# EAGLE design LickSensor_V3 (EAGLE 9.4.2)
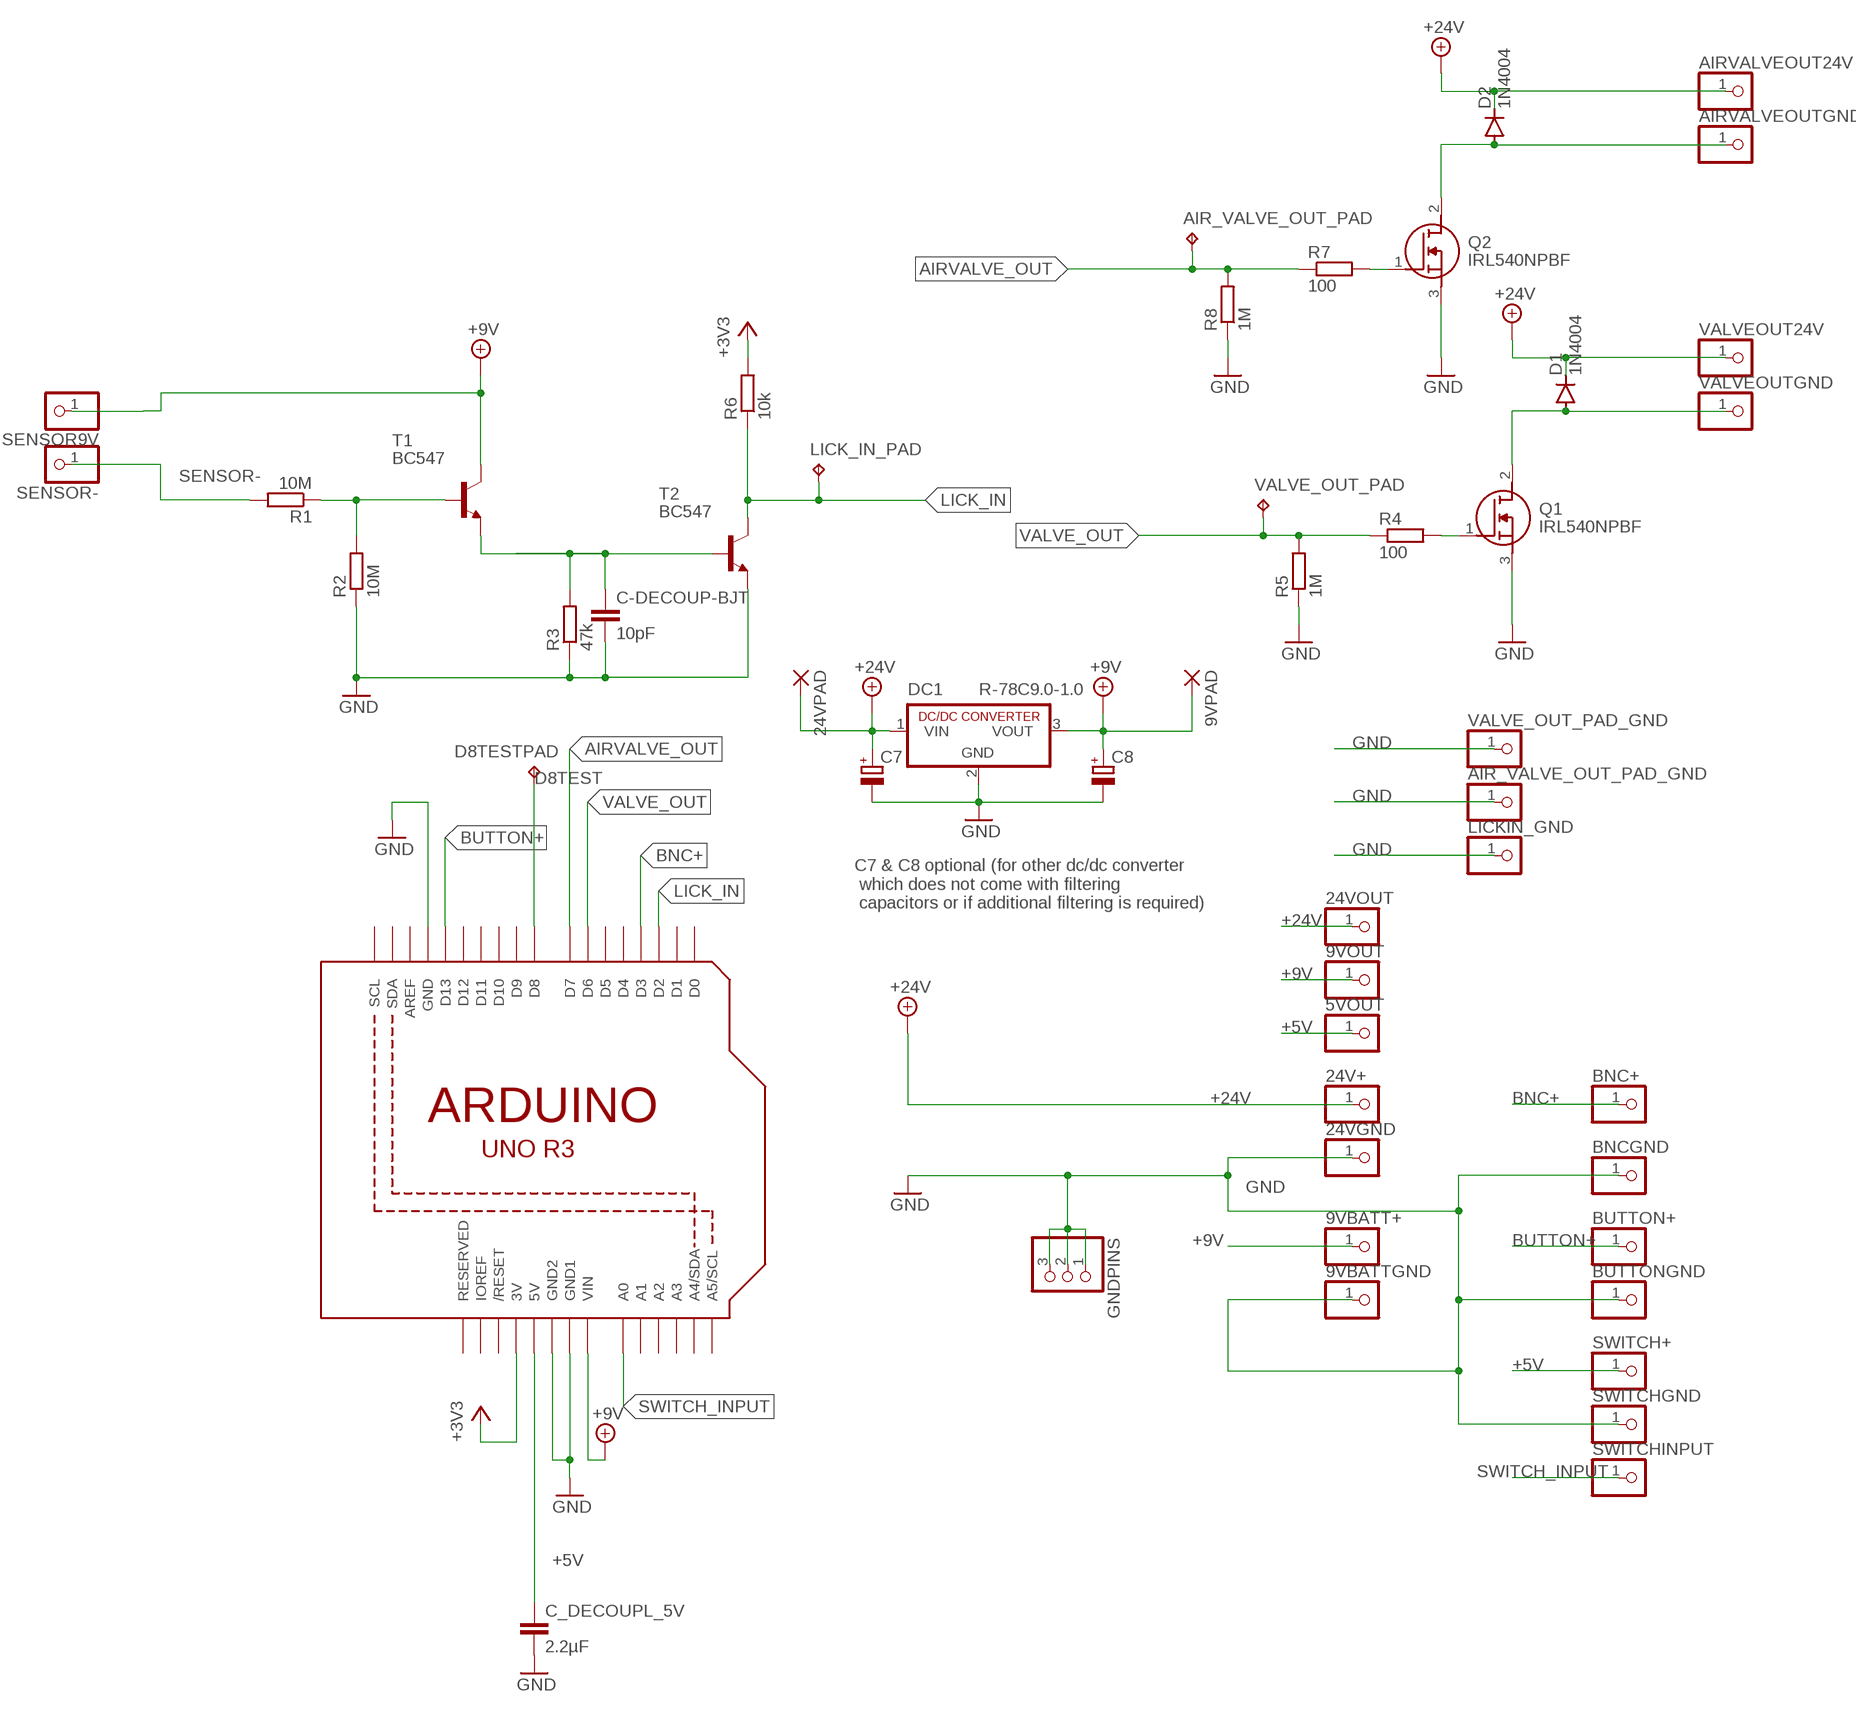
[diagram p0: schematic, sheet 1]

## Parts
5VOUT  PINHD-1X1  [1X01]
9VBATT+  PINHD-1X1  [1X01]
9VBATTGND  PINHD-1X1  [1X01]
9VOUT  PINHD-1X1  [1X01]
9VPAD  1,6/0,8  [1,6/0,8]
24V+  PINHD-1X1  [1X01]
24VGND  PINHD-1X1  [1X01]
24VOUT  PINHD-1X1  [1X01]
24VPAD  1,6/0,8  [1,6/0,8]
AIR_VALVE_OUT_PAD  TPPAD1-13  [P1-13]
AIR_VALVE_OUT_PAD_GND  PINHD-1X1  [1X01]
AIRVALVEOUT24V  PINHD-1X1  [1X01]
AIRVALVEOUTGND  PINHD-1X1  [1X01]
BNC+  PINHD-1X1  [1X01]
BNCGND  PINHD-1X1  [1X01]
BUTTON+  PINHD-1X1  [1X01]
BUTTONGND  PINHD-1X1  [1X01]
C7  CPOL-EUTT2D6  [TT2D6]
C8  CPOL-EUTT2D6  [TT2D6]
C-DECOUP-BJT  10pF  C-EU050-030X075  [C050-030X075]
C_DECOUPL_5V  2.2µF  C-EU050-030X075  [C050-030X075]
D1  1N4004  [DO41-10]
D2  1N4004  [DO41-10]
D8TESTPAD  TPPAD1-13  [P1-13]
DC1  R-78C9.0-1.0  [SIP3]
GNDPINS  PINHD-1X3  [1X03]
LICK_IN_PAD  TPPAD1-13  [P1-13]
LICKIN_GND  PINHD-1X1  [1X01]
Q1  IRL540NPBF  [TO254P469X1042X1967-3P]
Q2  IRL540NPBF  [TO254P469X1042X1967-3P]
R1  10M  R-EU_0207/7  [0207/7]
R2  10M  R-EU_0207/7  [0207/7]
R3  47k  R-EU_0207/7  [0207/7]
R4  100  R-EU_0204/7  [0204/7]
R5  1M  R-EU_0204/7  [0204/7]
R6  10k  R-EU_0204/7  [0204/7]
R7  100  R-EU_0204/7  [0204/7]
R8  1M  R-EU_0204/7  [0204/7]
SENSOR9V  PINHD-1X1  [1X01]
SENSOR-  PINHD-1X1  [1X01]
SWITCH+  PINHD-1X1  [1X01]
SWITCHGND  PINHD-1X1  [1X01]
SWITCHINPUT  PINHD-1X1  [1X01]
T1  BC547  [TO92]
T2  BC547  [TO92]
U1  ARDUINOR3-DIMENSION  [ARDUINOR3]
VALVE_OUT_PAD  TPPAD1-13  [P1-13]
VALVE_OUT_PAD_GND  PINHD-1X1  [1X01]
VALVEOUT24V  PINHD-1X1  [1X01]
VALVEOUTGND  PINHD-1X1  [1X01]

## Nets
+3V3: R6.2 U1.3V
+5V: 5VOUT.1 C_DECOUPL_5V.1 SWITCH+.1 U1.5V
+9V: 9VBATT+.1 9VOUT.1 9VPAD.1(P) C8.+ DC1.3(VOUT) SENSOR9V.1 T1.3(C) U1.VIN
+24V: 24V+.1 24VOUT.1 24VPAD.1(P) AIRVALVEOUT24V.1 C7.+ D1.C D2.C DC1.1(VIN) VALVEOUT24V.1
AIRVALVE_OUT: AIR_VALVE_OUT_PAD.TP R7.1 R8.2 U1.D7
BNC+: BNC+.1 U1.D3
BUTTON+: BUTTON+.1 U1.D13
D8TEST: D8TESTPAD.TP U1.D8
GND: 9VBATTGND.1 24VGND.1 AIR_VALVE_OUT_PAD_GND.1 BNCGND.1 BUTTONGND.1 C7.- C8.- C-DECOUP-BJT.2 C_DECOUPL_5V.2 DC1.2(GND) GNDPINS.1 GNDPINS.2 GNDPINS.3 LICKIN_GND.1 Q1.3(S) Q2.3(S) R2.1 R3.1 R5.1 R8.1 SWITCHGND.1 T2.1(E) U1.GND U1.GND1 U1.GND2 VALVE_OUT_PAD_GND.1
GND1: D1.A Q1.2(D) VALVEOUTGND.1
GND2: AIRVALVEOUTGND.1 D2.A Q2.2(D)
LICK_IN: LICK_IN_PAD.TP R6.1 T2.3(C) U1.D2
N$1: Q2.1(G) R7.2
N$4: Q1.1(G) R4.2
N$10: C-DECOUP-BJT.1 R3.2 T1.1(E) T2.2(B)
N$11: R1.1 R2.2 T1.2(B)
SENSOR-: R1.2 SENSOR-.1
SWITCH_INPUT: SWITCHINPUT.1 U1.A0
VALVE_OUT: R4.1 R5.2 U1.D6 VALVE_OUT_PAD.TP
Unconnected: U1.A1 U1.A2 U1.A3 U1.A4(A4/SDA) U1.A5(A5/SCL) U1.AREF U1.D0 U1.D1 U1.D4 U1.D5 U1.D9 U1.D10 U1.D11 U1.D12 U1.IOREF U1.RESERVED U1.RESET(/RESET) U1.SCL U1.SDA

## Notes on the sheet
- C7 & C8 optional (for other dc/dc converter
   which does not come with filtering
   capacitors or if additional filtering is required)

## Library data of the parts
5VOUT 9VBATT+ 9VBATTGND 9VOUT 24V+ 24VGND 24VOUT AIR_VALVE_OUT_PAD_GND AIRVALVEOUT24V AIRVALVEOUTGND BNC+ BNCGND BUTTON+ BUTTONGND LICKIN_GND SENSOR9V SENSOR- SWITCH+ SWITCHGND SWITCHINPUT VALVE_OUT_PAD_GND VALVEOUT24V VALVEOUTGND = adafruit:PINHD-1X1: Pin header 1x1 for 0.1" spacing With round pins
9VPAD 24VPAD = wirepad:1,6/0,8: THROUGH-HOLE PAD
AIR_VALVE_OUT_PAD D8TESTPAD LICK_IN_PAD VALVE_OUT_PAD = testpad:TP: Test pad
C7 C8 = rcl:CPOL-EU: POLARIZED CAPACITOR, European symbol; SPICEPREFIX: C
C-DECOUP-BJT C_DECOUPL_5V = rcl:C-EU: CAPACITOR, European symbol; SPICEPREFIX: C
D1 D2 = diode:1N4004: DIODE general purpose rectifier, 1 A
DC1 = dc-dc-converter:R-78C*-1.0: INNOLINE DC/DC-Converter 1.0 AMP SIP3 Single Output Source: Data sheet <http://www.mikrocontroller.net/attachment/150645/157764-da-01-en-DC_DC_WANDLER_R_78C5_0_1_0.pdf>
GNDPINS = adafruit:PINHD-1X3: PIN HEADER
Q1 Q2 = SamacSys_Parts:IRL540NPBF: N-channel MOSFET,IRL540N 30A 100V Source: Datasheet <https://www.infineon.com/dgdl/irl540npbf.pdf?fileId=5546d462533600a40153565fc2a62567>; ALLIED_NUMBER: 70017094; ALLIED_PRICE-STOCK: http://www.alliedelec.com/international-rectifier-irl540npbf/70017094/; DESCRIPTION: N-channel MOSFET,IRL540N 30A 100V; HEIGHT: 4.69mm; MANUFACTURER_NAME: International Rectifier; MANUFACTURER_PART_NUMBER: IRL540NPBF; MOUSER_PART_NUMBER: 942-IRL540NPBF; MOUSER_PRICE-STOCK: http://www.mouser.com/Search/ProductDetail.aspx?qs=9%252bKlkBgLFf0uZBCvyYsQoQ%3d%3d; RS_PART_NUMBER: 2509056052; RS_PRICE-STOCK: http://uk.rs-online.com/web/p/products/2509056052
R1-R8 = rcl:R-EU_: RESISTOR, European symbol; SPICEPREFIX: R
T1 T2 = transistor:BC547: NPN TRANSISTOR
U1 = adafruit:ARDUINOR3: This is a new object for the new Arduino R3 - with extra pins that you may want to use (such as IOref, and duplicated A4/A5

## Module TEST
Ports: 

### Library data of the parts

## Board
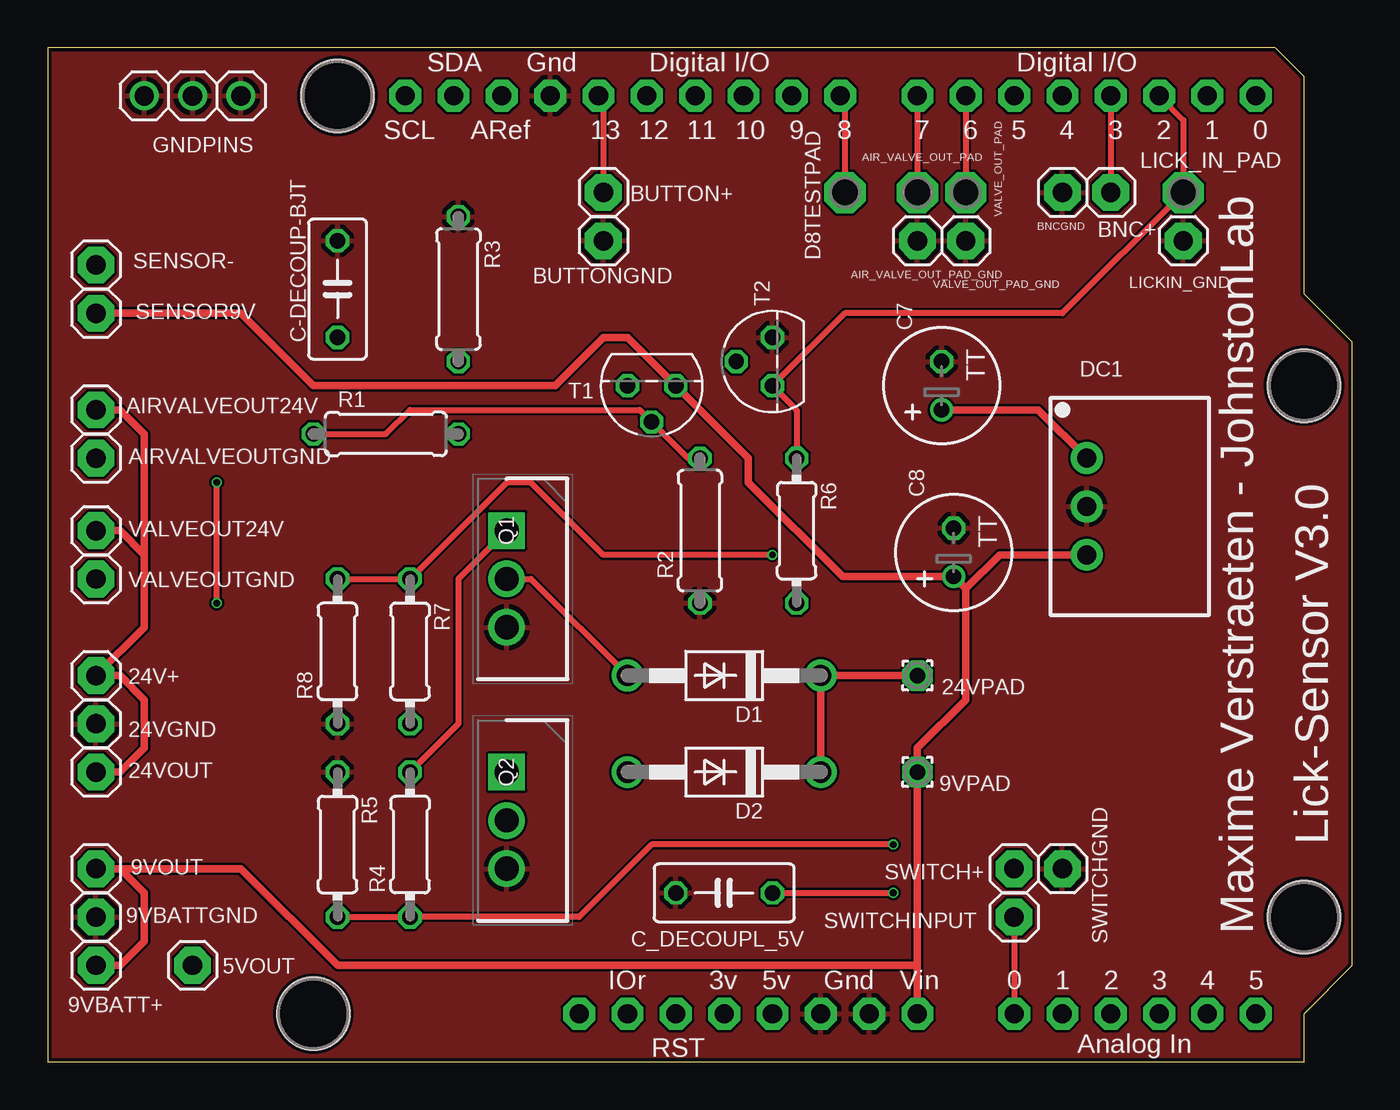
[diagram p1: board, top side]
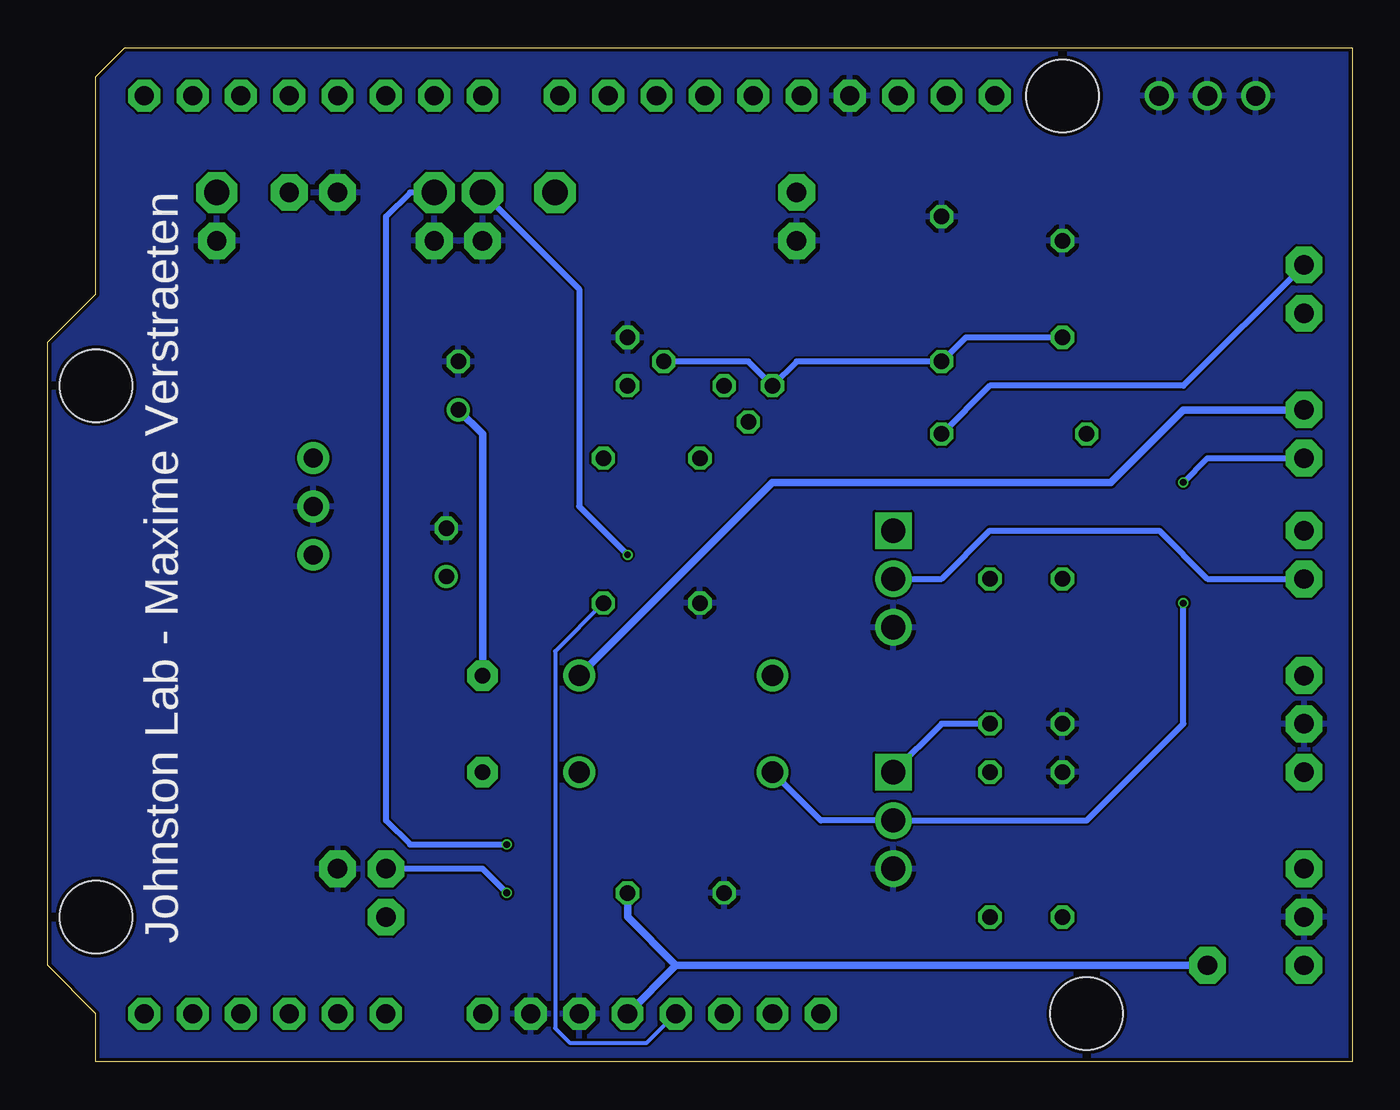
[diagram p2: board, bottom side, seen from below]

Size 68.58 x 53.34 mm. Coordinates in mm from the lower left corner, seen from the top.
Copper layers (1*16): Top 0.035559375mm / dielectric 1.6mm / Bottom 0.035559375mm
Design rules "jlcpcb2layer": minimum track width 5mil, minimum drill 12mil, track to track 5mil, track to pad 5mil, pad to pad 5mil, via to via 5mil, smd to smd 5mil, copper to edge 8mil, drill to drill 6mil, minimum pad ring 5mil, minimum via ring 3mil, stop-mask expansion 2.5mil, vias tented up to drill 0mil, thermal gap 10mil
Holes 3.81 mm at 15.24,50.8 66.04,35.56 66.04,7.62 13.97,2.54

### Footprints (pad centres in the part's own frame; a part is rotated, then mirrored left to right if it is on the bottom)
1X01 = drill 1.016 pad 1.93 octagon: 1 0,0
1,6/0,8 = drill 0.813 pad 1.6 octagon: 1 0,0
P1-13 = drill 1.321 pad 2.159 octagon: TP 0,0
TT2D6 = drill 0.813: + -1.27,0 | drill 0.813 octagon: - 1.27,0
C050-030X075 = drill 0.813 octagon: 1 -2.54,0; 2 2.54,0
DO41-10 = drill 1.118: A 5.08,0; C -5.08,0
SIP3 = drill 1 pad 1.676: 1 -2.54,0; 2 0,0; 3 2.54,0
1X03 = drill 1.016: 1 -2.54,0; 2 0,0; 3 2.54,0
TO254P469X1042X1967-3P = drill 1.28 pad 1.92 square: 1 0,0 | drill 1.28 pad 1.92: 2 2.54,0; 3 5.08,0
0207/7 = drill 0.813 octagon: 1 -3.81,0; 2 3.81,0
0204/7 = drill 0.813 octagon: 1 -3.81,0; 2 3.81,0
TO92 = drill 0.813 octagon: 1 1.27,0; 2 0,1.905; 3 -1.27,0
ARDUINOR3 = drill 1 pad 1.676 octagon: 3V 35.56,2.54; 5V 38.1,2.54; A0 50.8,2.54; A1 53.34,2.54; A2 55.88,2.54; A3 58.42,2.54; A4 60.96,2.54; A5 63.5,2.54; AREF 23.876,50.8; D0 63.5,50.8; D1 60.96,50.8; D2 58.42,50.8; D3 55.88,50.8; D4 53.34,50.8; D5 50.8,50.8; D6 48.26,50.8; D7 45.72,50.8; D8 41.656,50.8; D9 39.116,50.8; D10 36.576,50.8; D11 34.036,50.8; D12 31.496,50.8; D13 28.956,50.8; GND 26.416,50.8; GND1 43.18,2.54; GND2 40.64,2.54; IOREF 30.48,2.54; RESERVED 27.94,2.54; RESET 33.02,2.54; SCL 18.796,50.8; SDA 21.336,50.8; VIN 45.72,2.54

### Placement (x,y rotation side)
5VOUT  7.62,5.08 0 top
9VBATT+  2.54,5.08 0 top
9VBATTGND  2.54,7.62 0 top
9VOUT  2.54,10.16 0 top
9VPAD  45.72,15.24 0 top
24V+  2.54,20.32 0 top
24VGND  2.54,17.78 0 top
24VOUT  2.54,15.24 0 top
24VPAD  45.72,20.32 0 top
AIR_VALVE_OUT_PAD  45.72,45.72 0 top
AIR_VALVE_OUT_PAD_GND  45.72,43.18 0 top
AIRVALVEOUT24V  2.54,34.29 0 top
AIRVALVEOUTGND  2.54,31.75 0 top
BNC+  55.88,45.72 0 top
BNCGND  53.34,45.72 0 top
BUTTON+  29.21,45.72 0 top
BUTTONGND  29.21,43.18 0 top
C7  46.99,35.56 90 top
C8  47.62,26.8 90 top
C-DECOUP-BJT  15.24,40.64 90 top
C_DECOUPL_5V  35.56,8.89 180 top
D1  35.56,20.32 180 top
D2  35.56,15.24 180 top
D8TESTPAD  41.91,45.72 0 top
DC1  54.61,29.21 270 top
GNDPINS  7.62,50.8 0 top
LICK_IN_PAD  59.69,45.72 0 top
LICKIN_GND  59.69,43.18 0 top
Q1  24.13,27.94 270 top
Q2  24.13,15.24 270 top
R1  17.78,33.02 0 top
R2  34.29,27.94 90 top
R3  21.59,40.64 270 top
R4  19.05,11.43 90 top
R5  15.24,11.43 270 top
R6  39.37,27.94 270 top
R7  19.05,21.59 270 top
R8  15.24,21.59 90 top
SENSOR9V  2.54,39.37 0 top
SENSOR-  2.54,41.91 0 top
SWITCH+  50.8,10.16 0 top
SWITCHGND  53.34,10.16 0 top
SWITCHINPUT  50.8,7.62 0 top
T1  31.75,35.56 180 top
T2  38.1,36.83 90 top
U1  0,0 0 top
VALVE_OUT_PAD  48.26,45.72 0 top
VALVE_OUT_PAD_GND  48.26,43.18 0 top
VALVEOUT24V  2.54,27.94 0 top
VALVEOUTGND  2.54,25.4 0 top

### Tracks (layer width: path | path; a pad name or v marks a point on that pad's centre or on a via)
+3V3
  Bottom 0.203: R6.2 41.91,21.59 41.91,1.78 41.15,1.02 37.08,1.02 U1.3V
+5V  (via drill 0.35)
  Top 0.305: C_DECOUPL_5V.1 v44.45,8.89
  Bottom 0.305: v44.45,8.89 45.72,10.16 SWITCH+.1
  Bottom 0.406: 5VOUT.1 35.56,5.08 | 35.56,5.08 U1.5V | 35.56,5.08 38.1,7.62 C_DECOUPL_5V.1
+9V
  Top 0.406: U1.VIN 45.72,5.08 | 45.72,5.08 9VPAD.1 45.72,16.51 48.26,19.05 48.26,24.89 | 48.26,24.89 C8.+ 41.78,25.53 36.83,30.48 36.83,31.75 T1.3 30.48,38.1 29.21,38.1 26.67,35.56 13.97,35.56 10.16,39.37 SENSOR9V.1 | 48.26,24.89 50.04,26.67 DC1.3 | 9VBATT+.1 3.81,5.08 5.08,6.35 5.08,8.89 3.81,10.16 9VOUT.1 10.16,10.16 15.24,5.08 45.72,5.08
+24V
  Top 0.406: 24VOUT.1 3.81,15.24 5.08,16.51 5.08,19.05 3.81,20.32 24V+.1 5.08,22.86 5.08,26.67 | 5.08,26.67 3.81,27.94 VALVEOUT24V.1 | 5.08,26.67 5.08,33.02 3.81,34.29 AIRVALVEOUT24V.1 | 24VPAD.1 D1.C D2.C | C7.+ 52.07,34.29 DC1.1
  Bottom 0.406: 24VPAD.1 45.72,33.02 C7.+ | AIRVALVEOUT24V.1 8.89,34.29 12.7,30.48 30.48,30.48 D1.C
AIRVALVE_OUT  (via drill 0.35)
  Top 0.305: U1.D7 AIR_VALVE_OUT_PAD.TP | R8.2 R7.1 24.13,30.48 25.4,30.48 29.21,26.67 v38.1,26.67
  Bottom 0.305: v38.1,26.67 40.64,29.21 40.64,40.64 AIR_VALVE_OUT_PAD.TP
BNC+
  Top 0.305: U1.D3 BNC+.1
BUTTON+
  Top 0.305: U1.D13 29.21,50.55 BUTTON+.1
D8TEST
  Top 0.305: U1.D8 41.91,50.55 D8TESTPAD.TP
GND
  pour Bottom: 0,53.34 0,0 66.04,0 66.04,2.54 68.58,5.08 68.58,38.1 66.04,40.64 66.04,50.8 66.04,52.07 64.77,53.34
  pour Top: 0,53.34 0,0 66.04,0 66.04,2.54 68.58,5.08 68.58,38.1 66.04,40.64 66.04,52.07 64.77,53.34 63.5,53.34
GND1
  Top 0.305: Q1.2 25.4,25.4 D1.A
  Bottom 0.305: Q1.2 21.59,25.4 19.05,27.94 10.16,27.94 7.62,25.4 VALVEOUTGND.1
GND2  (via drill 0.35)
  Top 0.305: v8.89,24.13 v8.89,30.48
  Bottom 0.305: v8.89,24.13 8.89,17.78 13.97,12.7 Q2.2 27.94,12.7 D2.A | v8.89,30.48 7.62,31.75 AIRVALVEOUTGND.1
LICK_IN
  Top 0.305: U1.D2 59.69,49.53 LICK_IN_PAD.TP 53.34,39.37 41.91,39.37 T2.3 39.37,34.29 R6.1
N$1
  Bottom 0.305: R7.2 21.59,17.78 Q2.1
N$4
  Top 0.305: Q1.1 21.59,25.4 21.59,17.78 R4.2
N$10
  Bottom 0.305: C-DECOUP-BJT.1 20.32,38.1 R3.2 29.21,36.83 T1.1 31.75,36.83 T2.2
N$11
  Top 0.305: R1.1 17.78,33.02 19.05,34.29 31.12,34.29 T1.2 33.66,31.75 R2.2
SENSOR-
  Bottom 0.305: SENSOR-.1 8.89,35.56 19.05,35.56 R1.2
SWITCH_INPUT
  Top 0.305: SWITCHINPUT.1 U1.A0
VALVE_OUT  (via drill 0.35)
  Top 0.305: U1.D6 VALVE_OUT_PAD.TP | R5.2 R4.1 27.94,7.62 31.75,11.43 v44.45,11.43
  Bottom 0.305: VALVE_OUT_PAD.TP 49.53,45.72 50.8,44.45 50.8,12.7 49.53,11.43 v44.45,11.43

### Text on the board
tPlace: Lick-Sensor V3.0 | Maxime Verstraeten - JohnstonLab
bPlace: Johnston Lab - Maxime Verstraeten
bDocu: C7 & C8 optional (for other dc/dc / converter not featuring filtering / capacitors, or requires additional / filtering) ~1µF